# Altium schematic sheet SWatch_Schematic_1.SchDoc
size A4
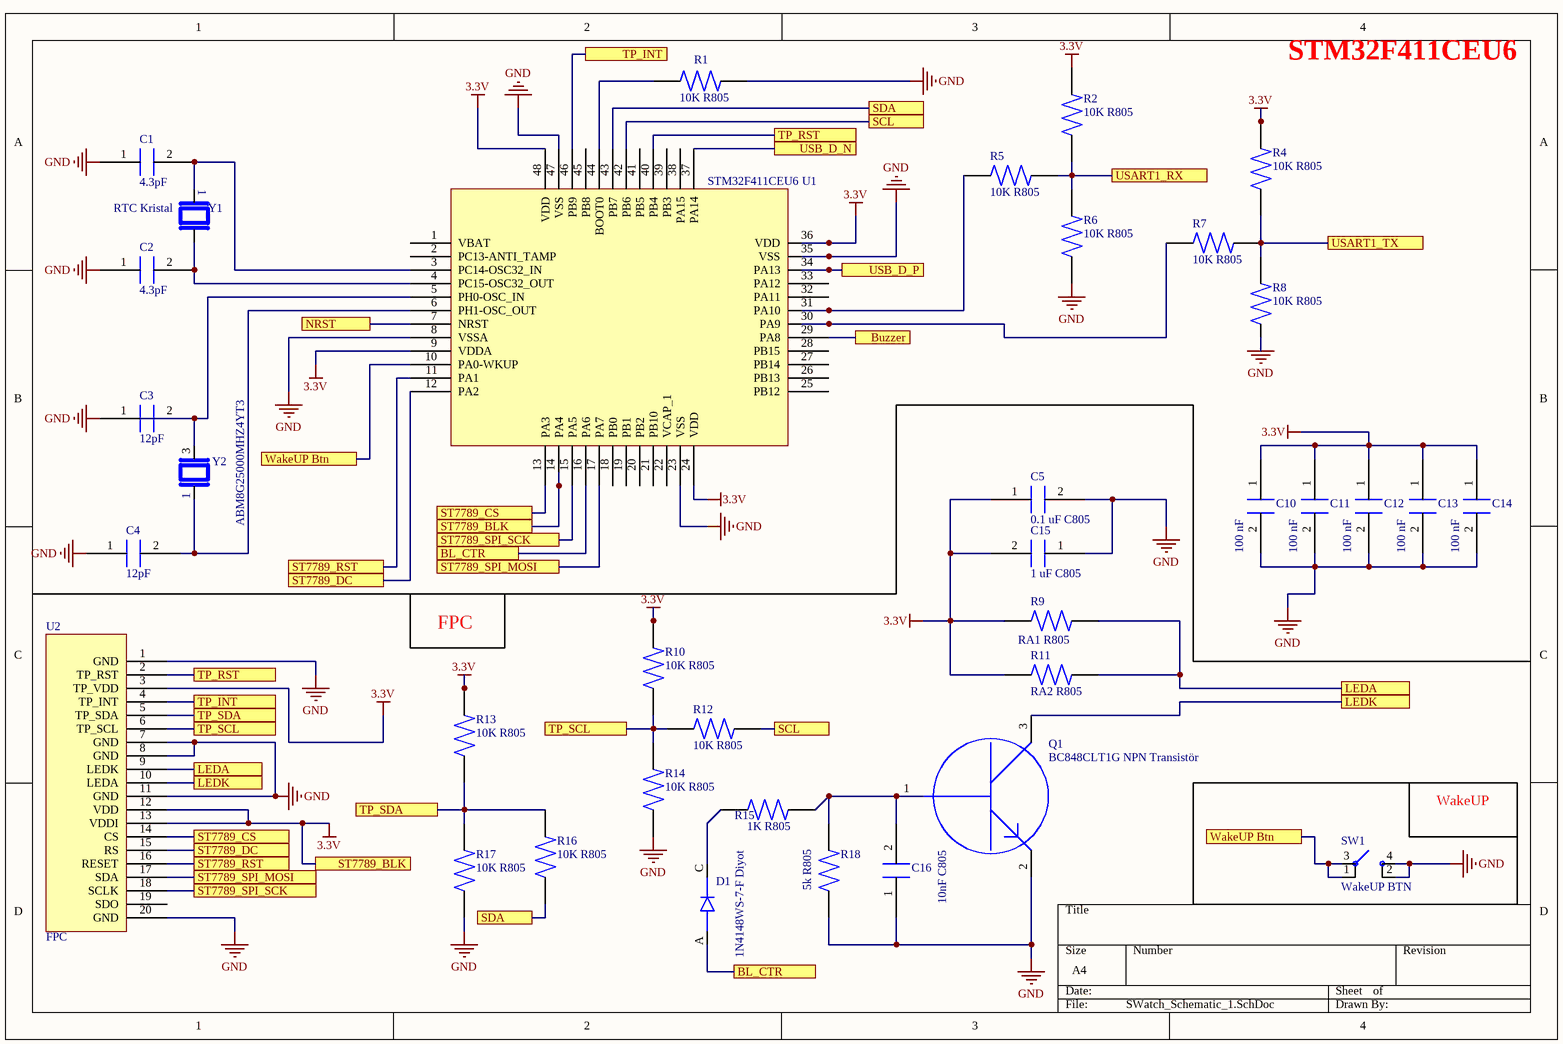
[diagram p0: SWatch_Schematic_1.SchDoc]

## Parts
C1  4.3pF  [4.3 pF C805]
C2  4.3pF  [4.3 pF C805]
C3  12pF  [12pF C805]
C4  12pF  [12pF C805]
C5  0.1 uF C805  [0.1 uF C805]
C10  100 nF  [100 nF C805]
C11  100 nF  [100 nF C805]
C12  100 nF  [100 nF C805]
C13  100 nF  [100 nF C805]
C14  100 nF  [100 nF C805]
C15  1 uF C805  [1 uF C805]
C16  10nF C805  [4.3 pF C805]
D1  1N4148WS-7-F Diyot  [1N4148WS-7-F Diyot]
Q1  BC848CLT1G NPN Transistör  [BC848CLT1G NPN Transistör]
R1  10K R805  [10K R805]
R2  10K R805  [10K R805]
R4  10K R805  [10K R805]
R5  10K R805  [10K R805]
R6  10K R805  [10K R805]
R7  10K R805  [10K R805]
R8  10K R805  [10K R805]
R9  RA1 R805  [1K R805]
R10  10K R805  [10K R805]
R11  RA2 R805  [1K R805]
R12  10K R805  [10K R805]
R13  10K R805  [10K R805]
R14  10K R805  [10K R805]
R15  1K R805  [1K R805]
R16  10K R805  [10K R805]
R17  10K R805  [10K R805]
R18  5k R805  [1.2K R805]
SW1  WakeUP BTN  [WakeUp BTN]
U1  STM32F411CEU6  [STM32F411CEU6]
U2  FPC  [FPC]
Y1  RTC Kristal  [32.768 KHZ RTC]
Y2  ABM8G25000MHZ4YT3  [ABM8G25000MHZ4YT3]

## Blocks framed on the sheet
WakeUP: SW1

## Ports
BL_CTR, Buzzer, LEDA, LEDK, NRST, SCL, SDA, ST7789_BLK, ST7789_CS, ST7789_DC, ST7789_RST, ST7789_SPI_MOSI, ST7789_SPI_SCK, TP_INT, TP_RST, TP_SCL, TP_SDA, USART1_RX, USART1_TX, USB_D_N, USB_D_P, WakeUP Btn

## Nets
3.3V: C5.1 C10.1 C11.1 C12.1 C13.1 C14.1 C15.2 R2.2 R4.2 R9.1 R10.2 R11.1 R13.2 U1.9(VDDA) U1.14(PA4) U1.24(VDD) U1.36(VDD) U1.48(VDD) U2.3(TP_VDD) U2.12(VDD) U2.13(VDDI) ; port ST7789_BLK
GND: C1.1 C2.1 C3.1 C4.1 C5.2 C10.2 C11.2 C12.2 C13.2 C14.2 C15.1 C16.1 Q1.2 R1.2 R6.1 R8.1 R14.1 R17.1 R18.1 SW1.2 SW1.4 U1.8(VSSA) U1.23(VSS) U1.35(VSS) U1.47(VSS) U2.1(GND) U2.7(GND) U2.8(GND) U2.11(GND) U2.20(GND)
BL_CTR: D1.A U1.16(PA6) ; port BL_CTR
Buzzer: U1.29(PA8) ; port Buzzer
LEDA: R9.2 R11.2 U2.9(LEDK) ; port LEDA
LEDK: Q1.3 U2.10(LEDA) ; port LEDK
NRST: U1.7(NRST) ; port NRST
SCL: R12.1 U1.42(PB6) ; port SCL
SDA: R16.1 U1.43(PB7) ; port SDA
ST7789_CS: U1.13(PA3) U2.14(CS) ; port ST7789_CS
ST7789_DC: U1.12(PA2) U2.15(RS) ; port ST7789_DC
ST7789_RST: U1.11(PA1) U2.16(RESET) ; port ST7789_RST
ST7789_SPI_MOSI: U1.17(PA7) U2.17(SDA) ; port ST7789_SPI_MOSI
ST7789_SPI_SCK: U1.15(PA5) U2.18(SCLK) ; port ST7789_SPI_SCK
TP_INT: U1.46(PB9) U2.4(TP_INT) ; port TP_INT
TP_RST: U1.40(PB4) U2.2(TP_RST) ; port TP_RST
TP_SCL: R10.1 R12.2 R14.2 U2.6(TP_SCL) ; port TP_SCL
TP_SDA: R13.1 R16.2 R17.2 U2.5(TP_SDA) ; port TP_SDA
USART1_RX: R2.1 R5.1 R6.2 ; port USART1_RX
USART1_TX: R4.1 R7.1 R8.2 ; port USART1_TX
USB_D_N: U1.37(PA14) ; port USB_D_N
USB_D_P: U1.34(PA13) ; port USB_D_P
WakeUP Btn: SW1.1 SW1.3 U1.10(PA0-WKUP) ; port WakeUP Btn
NetC1_2: C1.2 U1.3(PC14-OSC32_IN) Y1.1
NetC2_2: C2.2 U1.4(PC15-OSC32_OUT) Y1.2
NetC3_2: C3.2 U1.5(PH0-OSC_IN) Y2.3
NetC4_2: C4.2 U1.6(PH1-OSC_OUT) Y2.1
NetC16_2: C16.2 Q1.1 R15.2 R18.2
NetD1_C: D1.C R15.1
NetR1_1: R1.1 U1.44(BOOT0)
NetR5_2: R5.2 U1.31(PA10)
NetR7_2: R7.2 U1.30(PA9)

Not connected (* = marked no-connect by the designer): U1 1(VBAT) 2(PC13-ANTI_TAMP) 18(PB0) 19(PB1) 20(PB2) 21(PB10) 22(VCAP_1) 25(PB12) 26(PB13) 27(PB14) 28(PB15) 32(PA11) 33(PA12) 38(PA15) 39(PB3) 41(PB5) 45(PB8); U2 19(SDO)

## Notes on the sheet
- STM32F411CEU6
- FPC